# Altium schematic sheet [6] - Z7010 DDR INF.SchDoc: Z7010 DDRC INTERFACE
size B; Organization: Altium Limited; Address1: L3, 12a Rodborough Rd; Address2: Frenchs Forest; Address3: NSW; Address4: Australia 2086; DocumentNumber: 6; Revision: V1I1; SheetNumber: 6; SheetTotal: 16
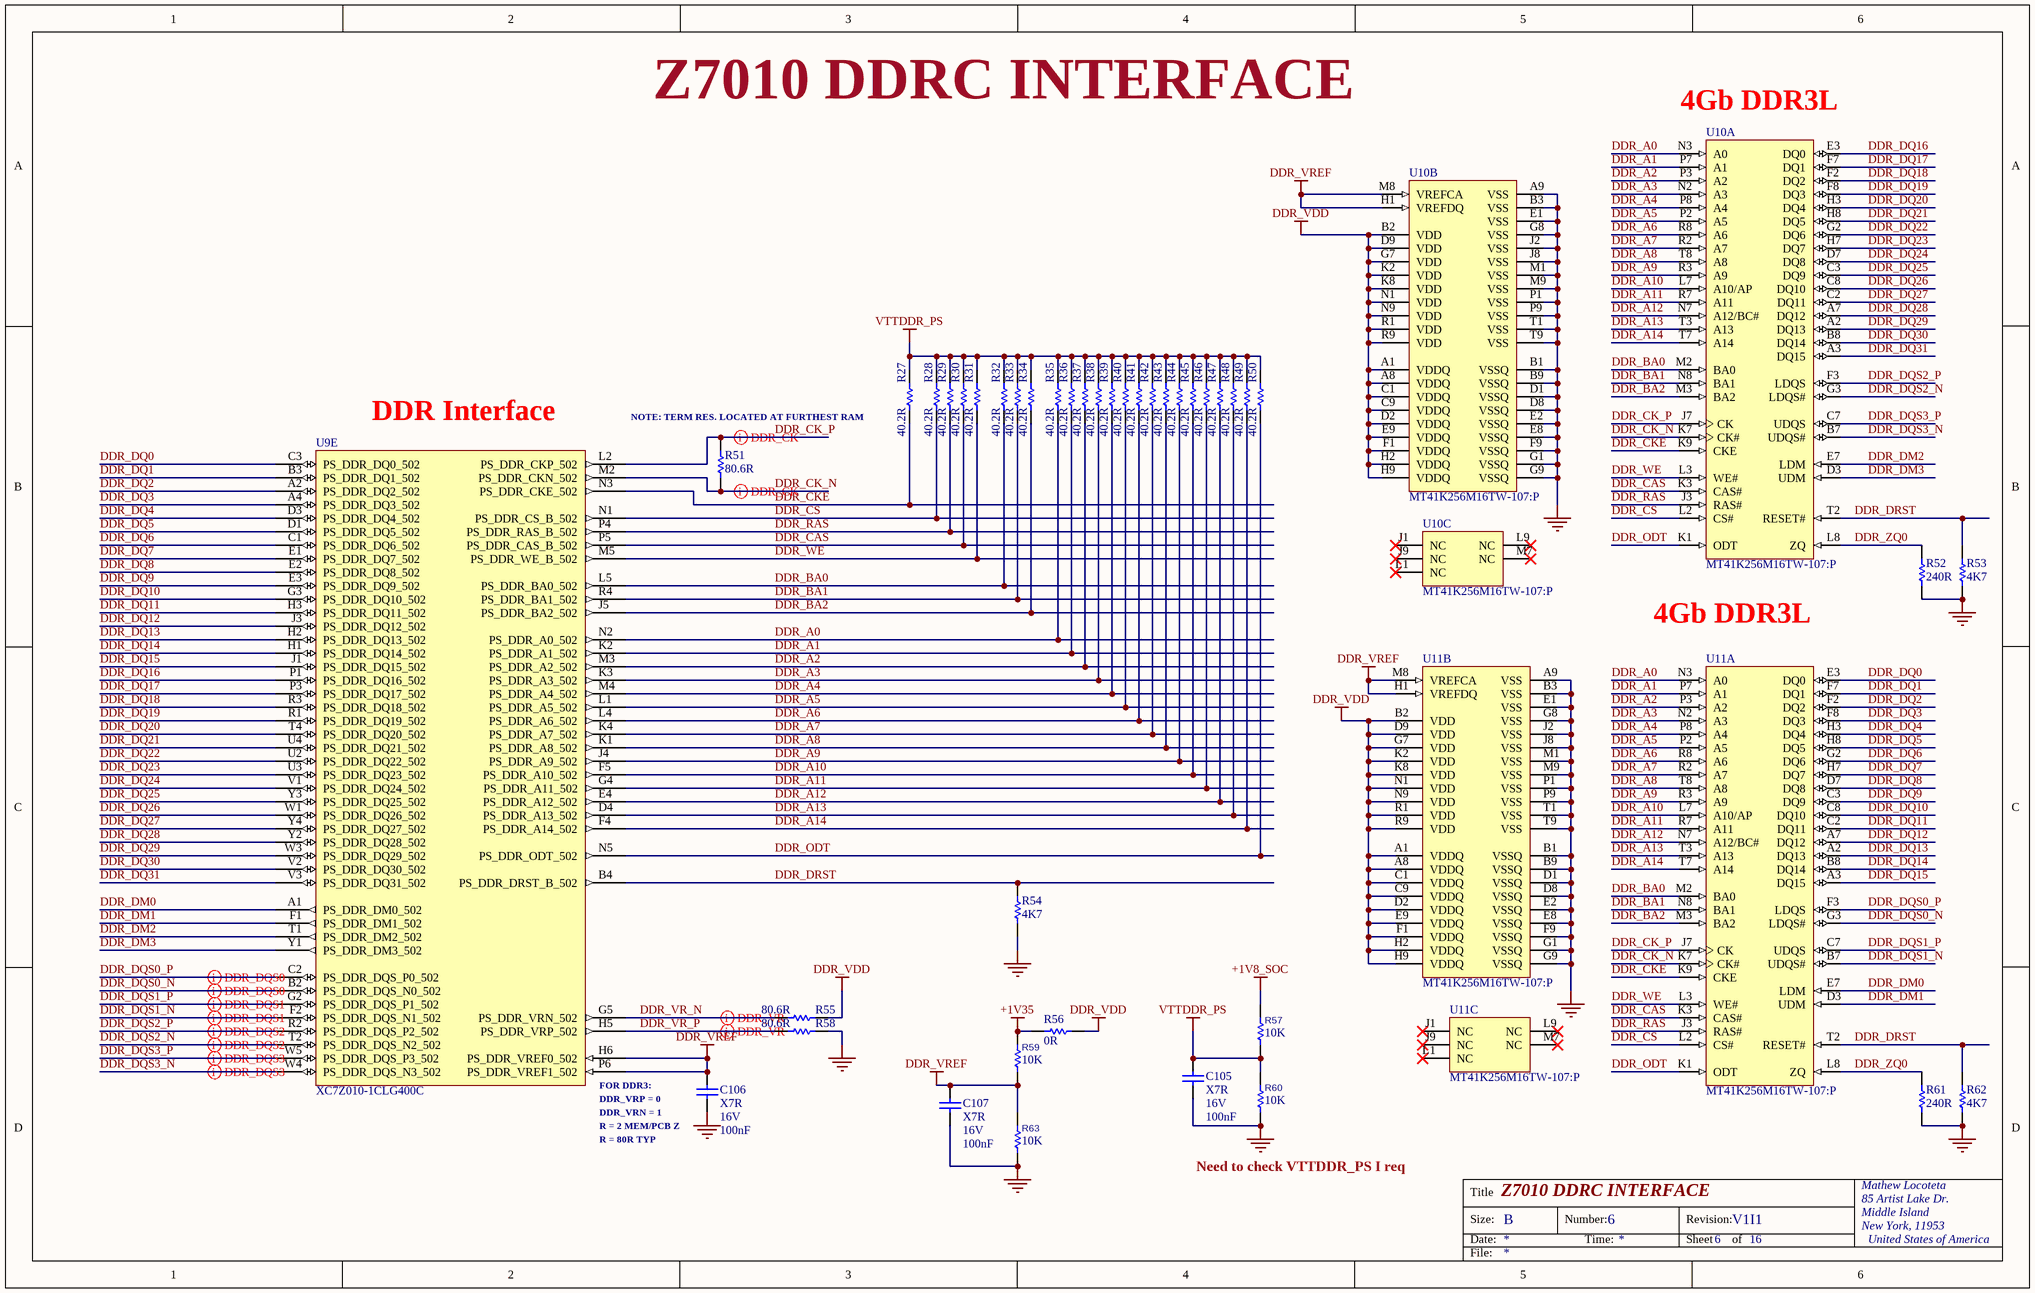
[diagram p0: [6] - Z7010 DDR INF.SchDoc]

## Parts
C105  Dielectric: X7R  Voltage Rating: 16V  Capacitance: 100nF  (hidden comment: 100nF 0402 16V)
C106  Dielectric: X7R  Voltage Rating: 16V  Capacitance: 100nF  (hidden comment: 100nF 0402 16V)
C107  Dielectric: X7R  Voltage Rating: 16V  Capacitance: 100nF  (hidden comment: 100nF 0402 16V)
R27  Resistance: 40.2R  (hidden comment: 40R2 1% 0402)
R28  Resistance: 40.2R  (hidden comment: 40R2 1% 0402)
R29  Resistance: 40.2R  (hidden comment: 40R2 1% 0402)
R30  Resistance: 40.2R  (hidden comment: 40R2 1% 0402)
R31  Resistance: 40.2R  (hidden comment: 40R2 1% 0402)
R32  Resistance: 40.2R  (hidden comment: 40R2 1% 0402)
R33  Resistance: 40.2R  (hidden comment: 40R2 1% 0402)
R34  Resistance: 40.2R  (hidden comment: 40R2 1% 0402)
R35  Resistance: 40.2R  (hidden comment: 40R2 1% 0402)
R36  Resistance: 40.2R  (hidden comment: 40R2 1% 0402)
R37  Resistance: 40.2R  (hidden comment: 40R2 1% 0402)
R38  Resistance: 40.2R  (hidden comment: 40R2 1% 0402)
R39  Resistance: 40.2R  (hidden comment: 40R2 1% 0402)
R40  Resistance: 40.2R  (hidden comment: 40R2 1% 0402)
R41  Resistance: 40.2R  (hidden comment: 40R2 1% 0402)
R42  Resistance: 40.2R  (hidden comment: 40R2 1% 0402)
R43  Resistance: 40.2R  (hidden comment: 40R2 1% 0402)
R44  Resistance: 40.2R  (hidden comment: 40R2 1% 0402)
R45  Resistance: 40.2R  (hidden comment: 40R2 1% 0402)
R46  Resistance: 40.2R  (hidden comment: 40R2 1% 0402)
R47  Resistance: 40.2R  (hidden comment: 40R2 1% 0402)
R48  Resistance: 40.2R  (hidden comment: 40R2 1% 0402)
R49  Resistance: 40.2R  (hidden comment: 40R2 1% 0402)
R50  Resistance: 40.2R  (hidden comment: 40R2 1% 0402)
R51  Resistance: 80.6R  (hidden comment: 80.6R 0402 1%)
R52  Resistance: 240R  (hidden comment: 240R 0402 1%)
R53  Resistance: 4K7  (hidden comment: 4K7 0402 1%)
R54  Resistance: 4K7  (hidden comment: 4K7 0402 1%)
R55  Resistance: 80.6R  (hidden comment: 80.6R 0402 1%)
R56  0R  [r0805]
R57  10K  [R0402]
R58  Resistance: 80.6R  (hidden comment: 80.6R 0402 1%)
R59  10K  [R0402]
R60  10K  [R0402]
R61  Resistance: 240R  (hidden comment: 240R 0402 1%)
R62  Resistance: 4K7  (hidden comment: 4K7 0402 1%)
R63  10K  [R0402]
U9  XC7Z010-1CLG400C  [CLG400]  (part E of 9)
U10  MT41K256M16TW-107:P  [MICT-TW-96]  (parts A,B,C of 3)
U11  MT41K256M16TW-107:P  [MICT-TW-96]  (parts A,B,C of 3)

## Nets
+1V8_SOC: R57.2
+1V35: R56.2 R59.2
DDR_VDD: R55.2 R56.1 U10.A1(VDDQ) U10.A8(VDDQ) U10.B2(VDD) U10.C1(VDDQ) U10.C9(VDDQ) U10.D2(VDDQ) U10.D9(VDD) U10.E9(VDDQ) U10.F1(VDDQ) U10.G7(VDD) U10.H2(VDDQ) U10.H9(VDDQ) U10.K2(VDD) U10.K8(VDD) U10.N1(VDD) U10.N9(VDD) U10.R1(VDD) U10.R9(VDD) U11.A1(VDDQ) U11.A8(VDDQ) U11.B2(VDD) U11.C1(VDDQ) U11.C9(VDDQ) U11.D2(VDDQ) U11.D9(VDD) U11.E9(VDDQ) U11.F1(VDDQ) U11.G7(VDD) U11.H2(VDDQ) U11.H9(VDDQ) U11.K2(VDD) U11.K8(VDD) U11.N1(VDD) U11.N9(VDD) U11.R1(VDD) U11.R9(VDD)
DDR_VREF: C106.2 C107.2 R59.1 R63.2 U9.H6(PS_DDR_VREF0_502) U9.P6(PS_DDR_VREF1_502) U10.H1(VREFDQ) U10.M8(VREFCA) U11.H1(VREFDQ) U11.M8(VREFCA)
GND: C105.1 C106.1 C107.1 R52.1 R53.1 R54.1 R58.2 R60.1 R61.1 R62.1 R63.1 U10.A9(VSS) U10.B1(VSSQ) U10.B3(VSS) U10.B9(VSSQ) U10.D1(VSSQ) U10.D8(VSSQ) U10.E1(VSS) U10.E2(VSSQ) U10.E8(VSSQ) U10.F9(VSSQ) U10.G1(VSSQ) U10.G8(VSS) U10.G9(VSSQ) U10.J2(VSS) U10.J8(VSS) U10.M1(VSS) U10.M9(VSS) U10.P1(VSS) U10.P9(VSS) U10.T1(VSS) U10.T9(VSS) U11.A9(VSS) U11.B1(VSSQ) U11.B3(VSS) U11.B9(VSSQ) U11.D1(VSSQ) U11.D8(VSSQ) U11.E1(VSS) U11.E2(VSSQ) U11.E8(VSSQ) U11.F9(VSSQ) U11.G1(VSSQ) U11.G8(VSS) U11.G9(VSSQ) U11.J2(VSS) U11.J8(VSS) U11.M1(VSS) U11.M9(VSS) U11.P1(VSS) U11.P9(VSS) U11.T1(VSS) U11.T9(VSS)
VTTDDR_PS: C105.2 R27.2 R28.2 R29.2 R30.2 R31.2 R32.2 R33.2 R34.2 R35.2 R36.2 R37.2 R38.2 R39.2 R40.2 R41.2 R42.2 R43.2 R44.2 R45.2 R46.2 R47.2 R48.2 R49.2 R50.2 R57.1 R60.2
DDR_A0: R35.1 U9.N2(PS_DDR_A0_502) U10.N3(A0) U11.N3(A0)
DDR_A1: R36.1 U9.K2(PS_DDR_A1_502) U10.P7(A1) U11.P7(A1)
DDR_A2: R37.1 U9.M3(PS_DDR_A2_502) U10.P3(A2) U11.P3(A2)
DDR_A3: R38.1 U9.K3(PS_DDR_A3_502) U10.N2(A3) U11.N2(A3)
DDR_A4: R39.1 U9.M4(PS_DDR_A4_502) U10.P8(A4) U11.P8(A4)
DDR_A5: R40.1 U9.L1(PS_DDR_A5_502) U10.P2(A5) U11.P2(A5)
DDR_A6: R41.1 U9.L4(PS_DDR_A6_502) U10.R8(A6) U11.R8(A6)
DDR_A7: R42.1 U9.K4(PS_DDR_A7_502) U10.R2(A7) U11.R2(A7)
DDR_A8: R43.1 U9.K1(PS_DDR_A8_502) U10.T8(A8) U11.T8(A8)
DDR_A9: R44.1 U9.J4(PS_DDR_A9_502) U10.R3(A9) U11.R3(A9)
DDR_A10: R45.1 U9.F5(PS_DDR_A10_502) U10.L7(A10/AP) U11.L7(A10/AP)
DDR_A11: R46.1 U9.G4(PS_DDR_A11_502) U10.R7(A11) U11.R7(A11)
DDR_A12: R47.1 U9.E4(PS_DDR_A12_502) U10.N7(A12/BC#) U11.N7(A12/BC#)
DDR_A13: R48.1 U9.D4(PS_DDR_A13_502) U10.T3(A13) U11.T3(A13)
DDR_A14: R49.1 U9.F4(PS_DDR_A14_502) U10.T7(A14) U11.T7(A14)
DDR_BA0: R32.1 U9.L5(PS_DDR_BA0_502) U10.M2(BA0) U11.M2(BA0)
DDR_BA1: R33.1 U9.R4(PS_DDR_BA1_502) U10.N8(BA1) U11.N8(BA1)
DDR_BA2: R34.1 U9.J5(PS_DDR_BA2_502) U10.M3(BA2) U11.M3(BA2)
DDR_CAS: R30.1 U9.P5(PS_DDR_CAS_B_502) U10.K3(CAS#) U11.K3(CAS#)
DDR_CK_N: R51.1 U9.M2(PS_DDR_CKN_502) U10.K7(CK#) U11.K7(CK#)
DDR_CK_P: R51.2 U9.L2(PS_DDR_CKP_502) U10.J7(CK) U11.J7(CK)
DDR_CKE: R27.1 U9.N3(PS_DDR_CKE_502) U10.K9(CKE) U11.K9(CKE)
DDR_CS: R28.1 U9.N1(PS_DDR_CS_B_502) U10.L2(CS#) U11.L2(CS#)
DDR_DM0: U9.A1(PS_DDR_DM0_502) U11.E7(LDM)
DDR_DM1: U9.F1(PS_DDR_DM1_502) U11.D3(UDM)
DDR_DM2: U9.T1(PS_DDR_DM2_502) U10.E7(LDM)
DDR_DM3: U9.Y1(PS_DDR_DM3_502) U10.D3(UDM)
DDR_DQ0: U9.C3(PS_DDR_DQ0_502) U11.E3(DQ0)
DDR_DQ1: U9.B3(PS_DDR_DQ1_502) U11.F7(DQ1)
DDR_DQ2: U9.A2(PS_DDR_DQ2_502) U11.F2(DQ2)
DDR_DQ3: U9.A4(PS_DDR_DQ3_502) U11.F8(DQ3)
DDR_DQ4: U9.D3(PS_DDR_DQ4_502) U11.H3(DQ4)
DDR_DQ5: U9.D1(PS_DDR_DQ5_502) U11.H8(DQ5)
DDR_DQ6: U9.C1(PS_DDR_DQ6_502) U11.G2(DQ6)
DDR_DQ7: U9.E1(PS_DDR_DQ7_502) U11.H7(DQ7)
DDR_DQ8: U9.E2(PS_DDR_DQ8_502) U11.D7(DQ8)
DDR_DQ9: U9.E3(PS_DDR_DQ9_502) U11.C3(DQ9)
DDR_DQ10: U9.G3(PS_DDR_DQ10_502) U11.C8(DQ10)
DDR_DQ11: U9.H3(PS_DDR_DQ11_502) U11.C2(DQ11)
DDR_DQ12: U9.J3(PS_DDR_DQ12_502) U11.A7(DQ12)
DDR_DQ13: U9.H2(PS_DDR_DQ13_502) U11.A2(DQ13)
DDR_DQ14: U9.H1(PS_DDR_DQ14_502) U11.B8(DQ14)
DDR_DQ15: U9.J1(PS_DDR_DQ15_502) U11.A3(DQ15)
DDR_DQ16: U9.P1(PS_DDR_DQ16_502) U10.E3(DQ0)
DDR_DQ17: U9.P3(PS_DDR_DQ17_502) U10.F7(DQ1)
DDR_DQ18: U9.R3(PS_DDR_DQ18_502) U10.F2(DQ2)
DDR_DQ19: U9.R1(PS_DDR_DQ19_502) U10.F8(DQ3)
DDR_DQ20: U9.T4(PS_DDR_DQ20_502) U10.H3(DQ4)
DDR_DQ21: U9.U4(PS_DDR_DQ21_502) U10.H8(DQ5)
DDR_DQ22: U9.U2(PS_DDR_DQ22_502) U10.G2(DQ6)
DDR_DQ23: U9.U3(PS_DDR_DQ23_502) U10.H7(DQ7)
DDR_DQ24: U9.V1(PS_DDR_DQ24_502) U10.D7(DQ8)
DDR_DQ25: U9.Y3(PS_DDR_DQ25_502) U10.C3(DQ9)
DDR_DQ26: U9.W1(PS_DDR_DQ26_502) U10.C8(DQ10)
DDR_DQ27: U9.Y4(PS_DDR_DQ27_502) U10.C2(DQ11)
DDR_DQ28: U9.Y2(PS_DDR_DQ28_502) U10.A7(DQ12)
DDR_DQ29: U9.W3(PS_DDR_DQ29_502) U10.A2(DQ13)
DDR_DQ30: U9.V2(PS_DDR_DQ30_502) U10.B8(DQ14)
DDR_DQ31: U9.V3(PS_DDR_DQ31_502) U10.A3(DQ15)
DDR_DQS0_N: U9.B2(PS_DDR_DQS_N0_502) U11.G3(LDQS#)
DDR_DQS0_P: U9.C2(PS_DDR_DQS_P0_502) U11.F3(LDQS)
DDR_DQS1_N: U9.F2(PS_DDR_DQS_N1_502) U11.B7(UDQS#)
DDR_DQS1_P: U9.G2(PS_DDR_DQS_P1_502) U11.C7(UDQS)
DDR_DQS2_N: U9.T2(PS_DDR_DQS_N2_502) U10.G3(LDQS#)
DDR_DQS2_P: U9.R2(PS_DDR_DQS_P2_502) U10.F3(LDQS)
DDR_DQS3_N: U9.W4(PS_DDR_DQS_N3_502) U10.B7(UDQS#)
DDR_DQS3_P: U9.W5(PS_DDR_DQS_P3_502) U10.C7(UDQS)
DDR_DRST: R53.2 R54.2 R62.2 U9.B4(PS_DDR_DRST_B_502) U10.T2(RESET#) U11.T2(RESET#)
DDR_ODT: R50.1 U9.N5(PS_DDR_ODT_502) U10.K1(ODT) U11.K1(ODT)
DDR_RAS: R29.1 U9.P4(PS_DDR_RAS_B_502) U10.J3(RAS#) U11.J3(RAS#)
DDR_VR_N: R55.1 U9.G5(PS_DDR_VRN_502)
DDR_VR_P: R58.1 U9.H5(PS_DDR_VRP_502)
DDR_WE: R31.1 U9.M5(PS_DDR_WE_B_502) U10.L3(WE#) U11.L3(WE#)
DDR_ZQ0: R52.2 R61.2 U10.L8(ZQ) U11.L8(ZQ)

Not connected (* = marked no-connect by the designer): U10 J1(NC)* J9(NC)* L1(NC)* L9(NC)* M7(NC)*; U11 J1(NC)* J9(NC)* L1(NC)* L9(NC)* M7(NC)*

## Layout directives
differential pair: DDR_CK_N, DDR_CK_P, DDR_DQS0_N, DDR_DQS0_P, DDR_DQS1_N, DDR_DQS1_P, DDR_DQS2_N, DDR_DQS2_P, DDR_DQS3_N, DDR_DQS3_P, DDR_VR_N, DDR_VR_P

## Notes on the sheet
- (near U10) 4Gb DDR3L
- Z7010 DDRC INTERFACE
- (near U9) DDR Interface
- (near R51) NOTE: TERM RES. LOCATED AT FURTHEST RAM
- 4Gb DDR3L
- (near U9) FOR DDR3:
- (near U9) DDR_VRP = 0
- DDR_VRN = 1
- R = 2 MEM/PCB Z
- R = 80R TYP
- (near R60) Need to check VTTDDR_PS I req
- Title
- Size:
- Date:
- B
- Number:
- Time:
- Revision:
- Sheet
- of
- Mathew Locoteta
- 85 Artist Lake Dr.
- Middle Island
- New York, 11953
- United States of America
- File:

## Library data of the parts
C105-C107 = C0402C104J4RACTU: KEMET - C0402C104J4RACTU - SMD Multilayer Ceramic Capacitor, 0.1 µF, 16 V, 0402 [1005 Metric], ± 5%, X7R, C Series KEMET; Dissipation Factor: 3.5%; Supplier 1: Digi-Key; Manufacturer: KEMET; Manufacturer Part Number: C0402C104J4RACTU; RoHS: Yes; Category: Ceramic Capacitors; Stock 1: 106350; Pricing 1: 1=0.48000, 10=0.33900, 50=0.25620, 100=0.22310, 500=0.16528, 1000=0.14049, 2500=0.13223, 5000=0.12396 (USD); Mount: Surface Mount,PCB; Case/Package: 0402; Case Code (Metric): 1005; Case Code (Imperial): 0402; Dielectric Material: Ceramic; Contact Plating: Tin,Matte; Min Operating Temperature: -55°C; Max Operating Temperature: 125°C; Tolerance: 5%; Packaging: Tape and Reel; Package Quantity: 1; Termination: SMD/SMT; Voltage: 16V; Length: 1mm; Height: 0.5mm; Width: 0.02inch; Thickness: 0.022inch; Depth: 0.5mm; Radiation Hardening: No; REACH SVHC: No SVHC; ComponentLink1URL: https://datasheet.ciiva.com/5415/kem-c1002-x7r-smd-5415819.pdf?src-supplier=Mouser; ComponentLink1Description: https://datasheet.ciiva.com/5415/kem-c1002-x7r-smd-5415819.pdf?src-supplier=Mouser; ComponentLink2URL: https://datasheet.ciiva.com/46424/1851736-46424159.pdf?src-supplier=Element14; ComponentLink2Description: https://datasheet.ciiva.com/46424/1851736-46424159.pdf?src-supplier=Element14; Supplier Part Number 1: 399-7761-1-ND; Voltage Rating (DC): 16V
R27-R50 = CRCW040240R2FKED: RES SMD 40.2 OHM 1% 1/16W 0402; Manufacturer: Vishay; Temperature Coefficient: 100ppm/°C; Power Rating: 63mW; Voltage Rating: 50V; Supplier 1: Digi-Key; Manufacturer Part Number: CRCW040240R2FKED; RoHS: Yes; Category: Chip SMD Resistors; Stock 1: 50000; Pricing 1: 1=0.10000, 10=0.03500, 100=0.01410, 1000=0.00633, 2500=0.00550, 5000=0.00454 (USD); Mount: Surface Mount; Number of Pins: 2; Weight: 2.3E-05oz; Contact Plating: Tin; Case Code (Metric): 1005; Case Code (Imperial): 0402; Min Operating Temperature: -55°C; Max Operating Temperature: 155°C; Tolerance: 1%; Composition: Thick Film; Packaging: Tape and Reel; Termination: SMD/SMT; Package Quantity: 10; Number of Terminations: 2; Max Power Dissipation: 63mW; Features: Automotive AEC-Q200; Military Standard: Not; Voltage Rating (DC): 50V; Length: 1mm; Height: 0.35mm; Width: 0.02inch; Depth: 0.5mm; Radiation Hardening: No; Lead Free: Lead Free; REACH SVHC: Unknown; ComponentLink1URL: https://datasheet.ciiva.com/11818/0900766b80d98824-11818096.pdf?src-supplier=RSComponents; ComponentLink1Description: https://datasheet.ciiva.com/11818/0900766b80d98824-11818096.pdf?src-supplier=RSComponents; ComponentLink2URL: https://datasheet.ciiva.com/2463/dcrcwe3-2463936.pdf?src-supplier=Digi-Key; ComponentLink2Description: https://datasheet.ciiva.com/2463/dcrcwe3-2463936.pdf?src-supplier=Digi-Key; ComponentLink3URL: https://datasheet.ciiva.com/7732/1697337-7732005.pdf?src-supplier=Element14; ComponentLink3Description: https://datasheet.ciiva.com/7732/1697337-7732005.pdf?src-supplier=Element14; ComponentLink4URL: https://datasheet.ciiva.com/16882/dcrcwe3-16882343.pdf?src-supplier=Avnet+Europe; ComponentLink4Description: https://datasheet.ciiva.com/16882/dcrcwe3-16882343.pdf?src-supplier=Avnet+Europe; ComponentLink5URL: https://datasheet.ciiva.com/16784/70201119-16784936.pdf?src-supplier=Allied+Electronics; ComponentLink5Description: https://datasheet.ciiva.com/16784/70201119-16784936.pdf?src-supplier=Allied+Electronics; ComponentLink6URL: https://datasheet.ciiva.com/3256/dcrcwe3-3256507.pdf?src-supplier=Avnet; ComponentLink6Description: https://datasheet.ciiva.com/3256/dcrcwe3-3256507.pdf?src-supplier=Avnet; ComponentLink7URL: https://datasheet.ciiva.com/22872/70201119-22872251.pdf?src-supplier=Allied+Electronics; ComponentLink7Description: https://datasheet.ciiva.com/22872/70201119-22872251.pdf?src-supplier=Allied+Electronics; ComponentLink8URL: https://datasheet.ciiva.com/2463/dcrcwe3-2463934.pdf?src-supplier=Digi-Key; ComponentLink8Description: https://datasheet.ciiva.com/2463/dcrcwe3-2463934.pdf?src-supplier=Digi-Key; ComponentLink9URL: https://datasheet.ciiva.com/2463/dcrcwe3-2463935.pdf?src-supplier=Digi-Key; ComponentLink9Description: https://datasheet.ciiva.com/2463/dcrcwe3-2463935.pdf?src-supplier=Digi-Key; Supplier Part Number 1: 541-40.2LDKR-ND; Case/Package: 0402
R51 R55 R58 = CRCW040280R6FKED: VISHAY         CRCW040280R6FKED             SMD Chip Resistor, Thick Film, 80.6 ohm, 50 V, 0402 [1005 Metric], 63 mW,  1%, CRCW Series; Temperature Coefficient: 100ppm/°C; Voltage Rating (DC): 50V; Power Rating: 63mW; Supplier 1: Newark; Manufacturer: Vishay; Manufacturer Part Number: CRCW040280R6FKED; RoHS: Yes; Category: Chip SMD Resistors; Stock 1: 15023; Pricing 1: 1=0.00300, 25=0.00300, 100=0.00300, 250=0.00300, 500=0.00300, 1000=0.00300 (USD); Weight: 2.3E-05oz; Case Code (Imperial): 0402; Case Code (Metric): 1005; Contact Plating: Tin; Min Operating Temperature: -55°C; Max Operating Temperature: 155°C; Packaging: Tape and Reel; Composition: Thick Film; Number of Terminations: 2; Package Quantity: 10; Max Power Dissipation: 63mW; Voltage Rating: 50V; Termination: SMD/SMT; Features: Automotive AEC-Q200; Military Standard: Not; Length: 1mm; Height: 0.35mm; Width: 0.5mm; Depth: 0.5mm; Radiation Hardening: No; Lead Free: Lead Free; REACH SVHC: Unknown; ComponentLink1URL: https://datasheet.ciiva.com/16761/70201119-16761304.pdf?src-supplier=Allied+Electronics; ComponentLink1Description: https://datasheet.ciiva.com/16761/70201119-16761304.pdf?src-supplier=Allied+Electronics; ComponentLink2URL: https://datasheet.ciiva.com/2463/dcrcwe3-2463676.pdf?src-supplier=Digi-Key; ComponentLink2Description: https://datasheet.ciiva.com/2463/dcrcwe3-2463676.pdf?src-supplier=Digi-Key; ComponentLink3URL: https://datasheet.ciiva.com/2463/dcrcwe3-2463677.pdf?src-supplier=Digi-Key; ComponentLink3Description: https://datasheet.ciiva.com/2463/dcrcwe3-2463677.pdf?src-supplier=Digi-Key; ComponentLink4URL: https://datasheet.ciiva.com/7822/1697337-7822957.pdf?src-supplier=Element14; ComponentLink4Description: https://datasheet.ciiva.com/7822/1697337-7822957.pdf?src-supplier=Element14; ComponentLink5URL: https://datasheet.ciiva.com/2463/dcrcwe3-2463678.pdf?src-supplier=Digi-Key; ComponentLink5Description: https://datasheet.ciiva.com/2463/dcrcwe3-2463678.pdf?src-supplier=Digi-Key; ComponentLink6URL: https://datasheet.ciiva.com/7823/1697337-7823166.pdf?src-supplier=Element14; ComponentLink6Description: https://datasheet.ciiva.com/7823/1697337-7823166.pdf?src-supplier=Element14; Supplier Part Number 1: 52K7297; Tolerance: 1%; Case/Package: 0402
R52 R61 = CRCW0402240RFKED: RES SMD 240 OHM 1% 1/16W 0402; Manufacturer: Vishay; Temperature Coefficient: 100ppm/°C; Power Rating: 63mW; Voltage Rating: 50V; Supplier 1: Digi-Key; Manufacturer Part Number: CRCW0402240RFKED; RoHS: Yes; Category: Chip SMD Resistors; Stock 1: 41893; Pricing 1: 1=0.10000, 10=0.03500, 100=0.01410, 1000=0.00633, 2500=0.00550, 5000=0.00454 (USD); Mount: Surface Mount; Case/Package: 0402; Weight: 2.3E-05oz; Contact Plating: Tin; Case Code (Metric): 1005; Case Code (Imperial): 0402; Min Operating Temperature: -55°C; Max Operating Temperature: 155°C; Composition: Thick Film; Termination: SMD/SMT; Packaging: Tape and Reel; Package Quantity: 10; Number of Terminations: 2; Max Power Dissipation: 63mW; Features: Automotive AEC-Q200; Military Standard: Not; Voltage Rating (DC): 50V; Working Voltage: 50V; Length: 1mm; Height: 0.35mm; Width: 0.02inch; Depth: 0.5mm; Radiation Hardening: No; Lead Free: Lead Free; REACH SVHC: Unknown; ComponentLink1URL: https://datasheet.ciiva.com/11809/0900766b80d98824-11809853.pdf?src-supplier=RSComponents; ComponentLink1Description: https://datasheet.ciiva.com/11809/0900766b80d98824-11809853.pdf?src-supplier=RSComponents; ComponentLink2URL: https://datasheet.ciiva.com/16886/dcrcwe3-16886728.pdf?src-supplier=Avnet+Europe; ComponentLink2Description: https://datasheet.ciiva.com/16886/dcrcwe3-16886728.pdf?src-supplier=Avnet+Europe; ComponentLink3URL: https://datasheet.ciiva.com/2463/dcrcwe3-2463067.pdf?src-supplier=Digi-Key; ComponentLink3Description: https://datasheet.ciiva.com/2463/dcrcwe3-2463067.pdf?src-supplier=Digi-Key; ComponentLink4URL: https://datasheet.ciiva.com/2463/dcrcwe3-2463068.pdf?src-supplier=Digi-Key; ComponentLink4Description: https://datasheet.ciiva.com/2463/dcrcwe3-2463068.pdf?src-supplier=Digi-Key; ComponentLink5URL: https://datasheet.ciiva.com/2463/dcrcwe3-2463069.pdf?src-supplier=Digi-Key; ComponentLink5Description: https://datasheet.ciiva.com/2463/dcrcwe3-2463069.pdf?src-supplier=Digi-Key; ComponentLink6URL: https://datasheet.ciiva.com/8954/dcrcwe3-8954621.pdf?src-supplier=Avnet; ComponentLink6Description: https://datasheet.ciiva.com/8954/dcrcwe3-8954621.pdf?src-supplier=Avnet; ComponentLink7URL: https://datasheet.ciiva.com/16204/dcrcwe3-16204941.pdf?src-supplier=Future+Electronics; ComponentLink7Description: https://datasheet.ciiva.com/16204/dcrcwe3-16204941.pdf?src-supplier=Future+Electronics; ComponentLink8URL: https://datasheet.ciiva.com/5546/dcrcwe3-109170-5546510.pdf?src-supplier=Mouser; ComponentLink8Description: https://datasheet.ciiva.com/5546/dcrcwe3-109170-5546510.pdf?src-supplier=Mouser; ComponentLink9URL: https://datasheet.ciiva.com/16780/70201119-16780206.pdf?src-supplier=Allied+Electronics; ComponentLink9Description: https://datasheet.ciiva.com/16780/70201119-16780206.pdf?src-supplier=Allied+Electronics; ComponentLink10URL: https://datasheet.ciiva.com/16784/70201119-16784686.pdf?src-supplier=Allied+Electronics; ComponentLink10Description: https://datasheet.ciiva.com/16784/70201119-16784686.pdf?src-supplier=Allied+Electronics; Supplier Part Number 1: 541-240LCT-ND; Tolerance: 1%
R53 R54 R62 = CRCW04024K70FKED: Resistor SMD 4.7 kOhm 0402 PU=10000 ST, CRCW04024K70FKED, Vishay; Power Rating: 63mW; Temperature Coefficient: 100ppm/°C; Voltage Rating: 50V; Supplier 1: Digi-Key; Manufacturer: Vishay; Manufacturer Part Number: CRCW04024K70FKED; RoHS: Yes; Category: Chip SMD Resistors; Stock 1: 575743; Pricing 1: 1=0.10000, 10=0.03500, 100=0.01410, 1000=0.00633, 2500=0.00550, 5000=0.00454 (USD); Mount: Surface Mount; Case/Package: 0402; Weight: 2.3E-05oz; Contact Plating: Tin; Case Code (Imperial): 0402; Case Code (Metric): 1005; Min Operating Temperature: -55°C; Max Operating Temperature: 155°C; Tolerance: 1%; Composition: Thick Film; Packaging: Tape and Reel; Package Quantity: 10; Termination: SMD/SMT; Military Standard: Not; Voltage Rating (DC): 50V; Number of Terminations: 2; Max Power Dissipation: 63mW; Features: Automotive AEC-Q200; Length: 1mm; Height: 0.35mm; Width: 0.5mm; Depth: 0.5mm; Radiation Hardening: No; Lead Free: Lead Free; REACH SVHC: Unknown; ComponentLink1URL: https://datasheet.ciiva.com/11808/0900766b80d98824-11808622.pdf?src-supplier=RSComponents; ComponentLink1Description: https://datasheet.ciiva.com/11808/0900766b80d98824-11808622.pdf?src-supplier=RSComponents; ComponentLink2URL: https://datasheet.ciiva.com/3256/dcrcwe3-3256597.pdf?src-supplier=Avnet; ComponentLink2Description: https://datasheet.ciiva.com/3256/dcrcwe3-3256597.pdf?src-supplier=Avnet; ComponentLink3URL: https://datasheet.ciiva.com/5550/dcrcwe3-109170-5550295.pdf?src-supplier=Mouser; ComponentLink3Description: https://datasheet.ciiva.com/5550/dcrcwe3-109170-5550295.pdf?src-supplier=Mouser; ComponentLink4URL: https://datasheet.ciiva.com/16764/70201119-16764281.pdf?src-supplier=Allied+Electronics; ComponentLink4Description: https://datasheet.ciiva.com/16764/70201119-16764281.pdf?src-supplier=Allied+Electronics; ComponentLink5URL: https://datasheet.ciiva.com/2463/dcrcwe3-2463034.pdf?src-supplier=Digi-Key; ComponentLink5Description: https://datasheet.ciiva.com/2463/dcrcwe3-2463034.pdf?src-supplier=Digi-Key; ComponentLink6URL: https://datasheet.ciiva.com/16881/dcrcwe3-16881690.pdf?src-supplier=Avnet+Europe; ComponentLink6Description: https://datasheet.ciiva.com/16881/dcrcwe3-16881690.pdf?src-supplier=Avnet+Europe; ComponentLink7URL: https://datasheet.ciiva.com/2463/dcrcwe3-2463035.pdf?src-supplier=Digi-Key; ComponentLink7Description: https://datasheet.ciiva.com/2463/dcrcwe3-2463035.pdf?src-supplier=Digi-Key; ComponentLink8URL: https://datasheet.ciiva.com/8079/1697337-8079643.pdf?src-supplier=Element14; ComponentLink8Description: https://datasheet.ciiva.com/8079/1697337-8079643.pdf?src-supplier=Element14; ComponentLink9URL: https://datasheet.ciiva.com/2463/dcrcwe3-2463036.pdf?src-supplier=Digi-Key; ComponentLink9Description: https://datasheet.ciiva.com/2463/dcrcwe3-2463036.pdf?src-supplier=Digi-Key; ComponentLink10URL: https://datasheet.ciiva.com/26316/fld-crcw-e3-data-en-26316654.pdf?src-supplier=Distrelec; ComponentLink10Description: https://datasheet.ciiva.com/26316/fld-crcw-e3-data-en-26316654.pdf?src-supplier=Distrelec; Supplier Part Number 1: 541-4.70KLCT-ND
R56 = RMCF0805ZT0R00: STACKPOLE ELECTRONICS - RMCF0805ZT0R00. - RES THKFLM 0805 0 OHM JUMPER 1/8W 200PPM/ C SMD ROHS COMPLIANT: YES; Resistance: 0mR; Power Rating: 125mW; Imax: 2A; Supplier 1: Digi-Key; Manufacturer: Stackpole Electronics; Manufacturer Part Number: RMCF0805ZT0R00; RoHS: Yes; Category: Chip SMD Resistors; Stock 1: 11365; Pricing 1: 1=0.10000, 10=0.01900, 25=0.01400, 50=0.01060, 100=0.00780, 250=0.00596, 500=0.00476, 1000=0.00350 (USD); Mount: Surface Mount; Case/Package: 0805; Case Code (Metric): 2012; Case Code (Imperial): 0805; Contact Plating: Tin,Matte; Min Operating Temperature: -55°C; Max Operating Temperature: 155°C; Packaging: Tape and Reel; Features: Automotive AEC-Q200; Composition: Thick Film; Number of Terminations: 2; Military Standard: Not; Max Power Dissipation: 125mW; Length: 2mm; Height: 0.026inch; Width: 0.049inch; Depth: 1.25mm; Radiation Hardening: No; Lead Free: Lead Free; ComponentLink1URL: https://datasheet.ciiva.com/15193/getdatasheetpartid-360417-15193658.pdf?src-supplier=Verical; ComponentLink1Description: https://datasheet.ciiva.com/15193/getdatasheetpartid-360417-15193658.pdf?src-supplier=Verical; Supplier Part Number 1: RMCF0805ZT0R00CT-ND
R57 R59 R60 R63 = RMCF0402FT10K0: RES 10K OHM 1% 1/16W 0402; Manufacturer: Stackpole Electronics; Resistance: 10kR; Power Rating: 62.5mW; Temperature Coefficient: 100ppm/°C; Max Power Dissipation: 63mW; Supplier 1: Digi-Key; Manufacturer Part Number: RMCF0402FT10K0; Stock 1: 6276240; Pricing 1: 1=0.10000, 10=0.01500, 100=0.00610, 1000=0.00275, 2500=0.00239, 5000=0.00198 (USD); RoHS: Yes; Mount: Surface Mount; Case/Package: 0402; Case Code (Metric): 1005; Case Code (Imperial): 0402; Contact Plating: Tin,Matte; Min Operating Temperature: -55°C; Max Operating Temperature: 155°C; Tolerance: 1%; Packaging: Tape and Reel; Composition: Thick Film; Number of Terminations: 2; Military Standard: Not; Features: Automotive AEC-Q200; Length: 1mm; Height: 0.016inch; Width: 0.02inch; Depth: 0.5mm; Radiation Hardening: No; Lead Free: Lead Free; ComponentLink1URL: https://datasheet.ciiva.com/24341/sei-rmcp-24341800.pdf?src-supplier=Onlinecomponents.com; ComponentLink1Description: https://datasheet.ciiva.com/24341/sei-rmcp-24341800.pdf?src-supplier=Onlinecomponents.com; Supplier Part Number 1: RMCF0402FT10K0DKR-ND
U9 = CMP-0363-00007-3: 667 MHz Zynq™-7000 AP SoC, 130 PS I/O, 100 FPGA I/O, 400-Ball BGA, Speed Grade 1, Commercial Grade, Pb-Free; Flip Flops: 35200; Speed Grade: -1; LUTs: 17600; Extensible Block RAM (# 36Kb Blocks): 240 KB (60); ComponentLink6Description: PCB and Layout Guide; ComponentLink3Description: DC and AC Switching Characteristics; ComponentLink2URL: http://www.xilinx.com/support/documentation/user_guides/ug865-Zynq-7000-Pkg-Pinout.pdf; PackageReference: CLG400; ComponentLink3URL: http://www.xilinx.com/support/documentation/data_sheets/ds187-XC7Z010-XC7Z020-Data-Sheet.pdf; DatasheetVersion: v1.2; Generic Part Number: XC7Z010; ComponentLink2Description: Package Specification; ComponentLink1Description: Datasheet; PartNumber: XC7Z010-1CLG400C; ComponentLink5Description: Packaging and Pinout; Code_JEDEC: MO-275-MMAA-1; RoHS: Pb-Free; ComponentLink5URL: http://www.xilinx.com/support/documentation/user_guides/ug865-Zynq-7000-Pkg-Pinout.pdf; ComponentLink1URL: http://www.xilinx.com/support/documentation/data_sheets/ds190-Zynq-7000-Overview.pdf; ComponentLink4Description: Package File; ComponentLink4URL: http://www.xilinx.com/support/packagefiles/z7packages/xc7z010clg400pkg.txt; PackageDescription: Wire-Bond Chip-Scale BGA, Body 17 x 17 mm, 0.8 mm Pitch; PackageVersion: Rev 1.1, 09/2012; Mounting Technology: Surface Mount; ComponentLink6URL: http://www.xilinx.com/support/documentation/user_guides/ug483_7Series_PCB.pdf
U10 U11 = CMP-2000-07475-1: DDR3L SDRAM, 4 GB, 933 MHz, 1.283 to 1.45 V, 0 to 95 degC, 96-Pin FBGA, RoHS, Tray; Manufacturer: Micron; Density: 4Gb; Memory Type: RAM; Access Time: 20ns; Frequency: 933MHz; Address Bus Width: 15b; Interface: Parallel; Data Bus Width: 16b; Mount: SurfaceMount; RoHSCompliant: true; Min Operating Temperature: 0degC; Package Description: 96-Ball Fine Pitch Ball Grid Array, Body 14 x 8 mm, Pitch 0.8 mm; Datasheet URL: https://www.micron.com/~/media/documents/products/data-sheet/dram/ddr3/4gb_ddr3l.pdf; Max Frequency: 933MHz; Contact Plating: Silver; Max Operating Temperature: 95degC; Case\/Package: FBGA; Datasheet Version: Rev. P, 05/2017; Manufacturer URL: http://www.micron.com/; Package Reference: TW-96; Mounting Technology: SurfaceMount